# Altium schematic sheet P04-NET.SchDoc
size 817 x 513 mm
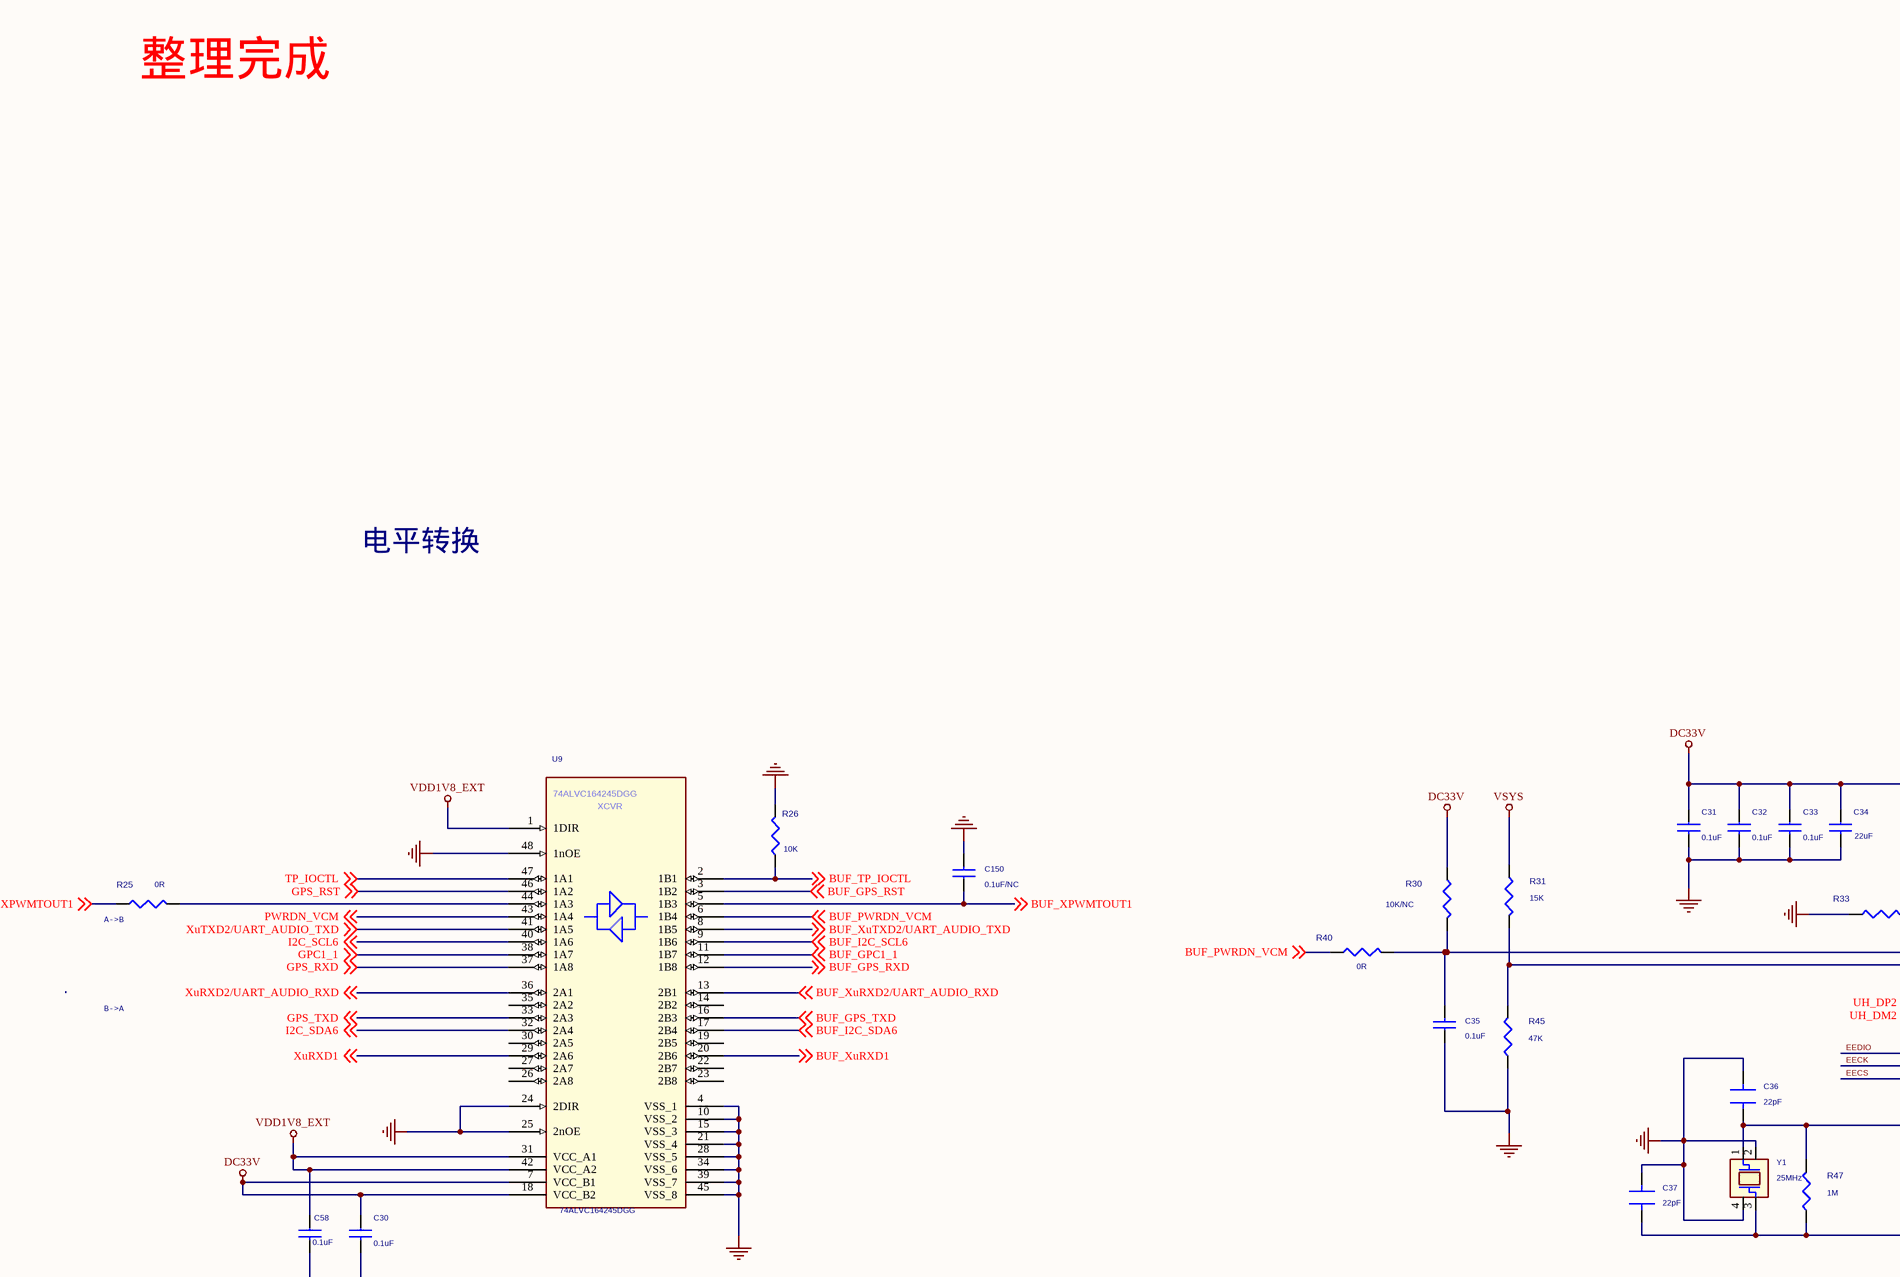
[diagram p0: P04-NET.SchDoc, top left]
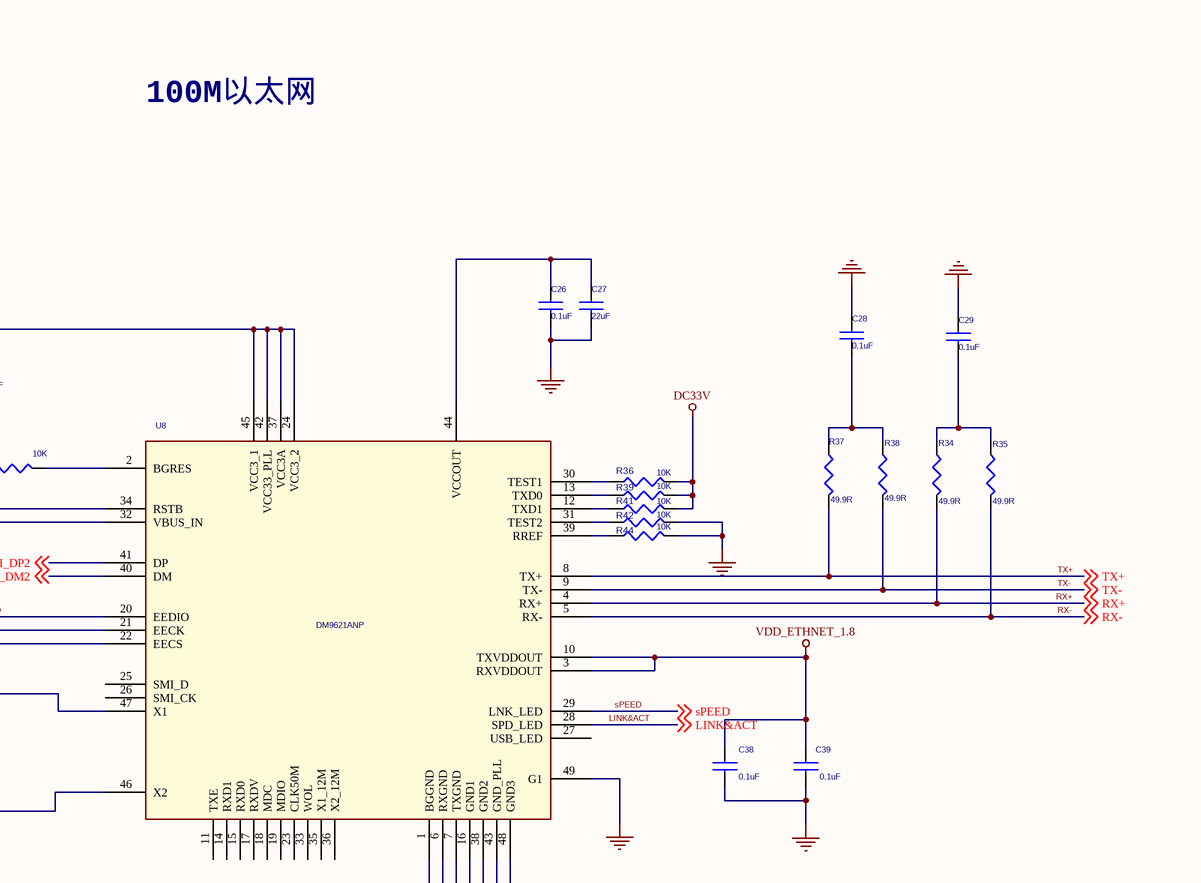
[diagram p1: P04-NET.SchDoc, top right]
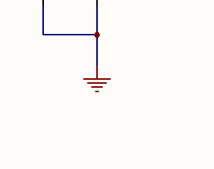
[diagram p2: P04-NET.SchDoc, bottom left]
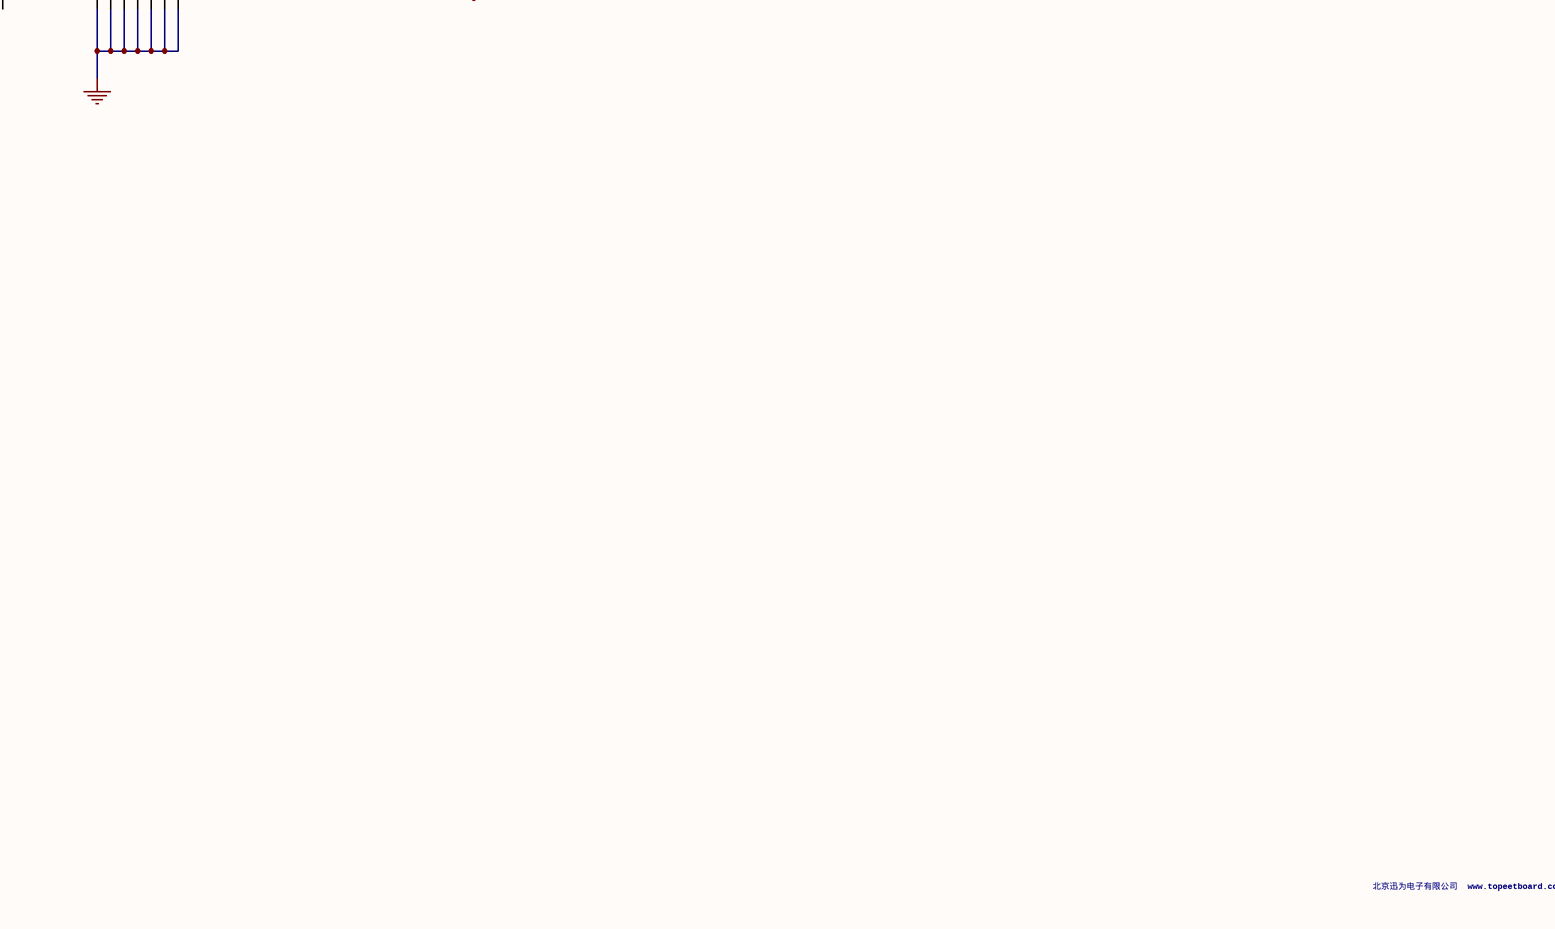
[diagram p3: P04-NET.SchDoc, bottom right]

## Parts
C26  0.1uF  [C0603-S]
C27  22uF  [C1206-S]
C28  0.1uF  [C0603-S]
C29  0.1uF  [C0603-S]
C30  0.1uF  [C0603-S]
C31  0.1uF  [C0603-S]
C32  0.1uF  [C0603-S]
C33  0.1uF  [C0603-S]
C34  22uF  [C1206-S]
C35  0.1uF  [C0603-S]
C36  22pF  [C0603-S]
C37  22pF  [C0603-S]
C38  0.1uF  [C0603-S]
C39  0.1uF  [C0603-S]
C58  0.1uF  [C0603-S]
C150  0.1uF/NC  [C0603-S]
R25  0R  [R0603-S]
R26  10K  [R0603-S]
R30  10K/NC  [R0603-S]
R31  15K  [R0603-S]
R33  10K  [R0603-S]
R34  49.9R  [R0805-S]
R35  49.9R  [R0805-S]
R36  10K  [R0603-S]
R37  49.9R  [R0805-S]
R38  49.9R  [R0805-S]
R39  10K  [R0603-S]
R40  0R  [R0603-S]
R41  10K  [R0603-S]
R42  10K  [R0603-S]
R44  10K  [R0603-S]
R45  47K  [R0603-S]
R47  1M  [R0603-S]
U8  DM9621ANP  [QFN48-050-0707LH]
U9  PART_NUMBER: 74ALVC164245DGG  [TSSOP_48]  (hidden comment: U-74ALVC164245DGG)
Y1  25MHz  [X4-2_5X3_2]

## Nets
DC33V: C30.1 C31.1 C32.1 C33.1 C34.1 R30.2 R36.1 R39.1 R41.1 U8.24(VCC3_2) U8.37(VCC3A) U8.42(VCC33_PLL) U8.45(VCC3_1) U9.7(VCC_B1) U9.18(VCC_B2)
GND: C26.2 C27.2 C28.1 C29.1 C30.2 C31.2 C32.2 C33.2 C34.2 C35.1 C36.2 C37.2 C38.2 C39.2 C58.2 C150.2 R26.1 R33.2 R42.1 R44.1 R45.2 U8.1(BGGND) U8.6(RXGND) U8.7(TXGND) U8.16(GND1) U8.38(GND2) U8.43(GND_PLL) U8.48(GND3) U8.49(G1) U9.4(VSS_1) U9.10(VSS_2) U9.15(VSS_3) U9.21(VSS_4) U9.24(2DIR) U9.25(2nOE) U9.28(VSS_5) U9.34(VSS_6) U9.39(VSS_7) U9.45(VSS_8) U9.48(1nOE) Y1.2(GND) Y1.4(GND)
VDD1V8_EXT: C58.1 U9.1(1DIR) U9.31(VCC_A1) U9.42(VCC_A2)
VDD_ETHNET_1.8: C38.1 C39.1 U8.3(RXVDDOUT) U8.10(TXVDDOUT)
VSYS: R31.2
BUF_GPC1_1: U9.11(1B7) ; off-sheet BUF_GPC1_1
BUF_GPS_RST: U9.3(1B2) ; off-sheet BUF_GPS_RST
BUF_GPS_RXD: U9.12(1B8) ; off-sheet BUF_GPS_RXD
BUF_GPS_TXD: U9.16(2B3) ; off-sheet BUF_GPS_TXD
BUF_I2C_SCL6: U9.9(1B6) ; off-sheet BUF_I2C_SCL6
BUF_I2C_SDA6: U9.17(2B4) ; off-sheet BUF_I2C_SDA6
BUF_PWRDN_VCM: R40.2 U9.6(1B4) ; off-sheet BUF_PWRDN_VCM
BUF_TP_IOCTL: R26.2 U9.2(1B1) ; off-sheet BUF_TP_IOCTL
BUF_XPWMTOUT1: C150.1 U9.5(1B3) ; off-sheet BUF_XPWMTOUT1
BUF_XuRXD1: U9.20(2B6) ; off-sheet BUF_XuRXD1
BUF_XuRXD2/UART_AUDIO_RXD: U9.13(2B1) ; off-sheet BUF_XuRXD2/UART_AUDIO_RXD
BUF_XuTXD2/UART_AUDIO_TXD: U9.8(1B5) ; off-sheet BUF_XuTXD2/UART_AUDIO_TXD
EECK: U8.21(EECK)
EECS: U8.22(EECS)
EEDIO: U8.20(EEDIO)
GPC1_1: U9.38(1A7) ; off-sheet GPC1_1
GPS_RST: U9.46(1A2) ; off-sheet GPS_RST
GPS_RXD: U9.37(1A8) ; off-sheet GPS_RXD
GPS_TXD: U9.33(2A3) ; off-sheet GPS_TXD
I2C_SCL6: U9.40(1A6) ; off-sheet I2C_SCL6
I2C_SDA6: U9.32(2A4) ; off-sheet I2C_SDA6
LINK&ACT: U8.28(SPD_LED) ; off-sheet LINK&ACT
PWRDN_VCM: U9.43(1A4) ; off-sheet PWRDN_VCM
RX+: R34.1 U8.4(RX+) ; off-sheet RX+
RX-: R35.1 U8.5(RX-) ; off-sheet RX-
sPEED: U8.29(LNK_LED) ; off-sheet sPEED
TP_IOCTL: U9.47(1A1) ; off-sheet TP_IOCTL
TX+: R37.1 U8.8(TX+) ; off-sheet TX+
TX-: R38.1 U8.9(TX-) ; off-sheet TX-
UH_DM2: U8.40(DM) ; off-sheet UH_DM2
UH_DP2: U8.41(DP) ; off-sheet UH_DP2
XPWMTOUT1: R25.2 ; off-sheet XPWMTOUT1
XuRXD1: U9.29(2A6) ; off-sheet XuRXD1
XuRXD2/UART_AUDIO_RXD: U9.36(2A1) ; off-sheet XuRXD2/UART_AUDIO_RXD
XuTXD2/UART_AUDIO_TXD: U9.41(1A5) ; off-sheet XuTXD2/UART_AUDIO_TXD
NetC26_1: C26.1 C27.1 U8.44(VCCOUT)
NetC28_2: C28.2 R37.2 R38.2
NetC29_2: C29.2 R34.2 R35.2
NetC35_2: C35.2 R30.1 R40.1 U8.34(RSTB)
NetC36_1: C36.1 R47.1 U8.47(X1) Y1.1(CIN)
NetC37_1: C37.1 R47.2 U8.46(X2) Y1.3(COUT)
NetR25_1: R25.1 U9.44(1A3)
NetR31_1: R31.1 R45.1 U8.32(VBUS_IN)
NetR33_1: R33.1 U8.2(BGRES)
NetR36_2: R36.2 U8.30(TEST1)
NetR39_2: R39.2 U8.13(TXD0)
NetR41_2: R41.2 U8.12(TXD1)
NetR42_2: R42.2 U8.31(TEST2)
NetR44_2: R44.2 U8.39(RREF)

Not connected (* = marked no-connect by the designer): U8 11(TXE) 14(RXD1) 15(RXD0) 17(RXDV) 18(MDC) 19(MDIO) 23(CLK50M) 25(SMI_D) 26(SMI_CK) 27(USB_LED) 33(WOL) 35(X1_12M) 36(X2_12M); U9 14(2B2) 19(2B5) 22(2B7) 23(2B8) 26(2A8) 27(2A7) 30(2A5) 35(2A2)

## Notes on the sheet
- 整理完成
- 电平转换
- 100M以太网
- (near R25) A->B
- B->A
- 北京迅为电子有限公司  www.topeetboard.com
- (in symbol U-74ALVC164245DGG) XCVR

## Library data of the parts
C26 C28-C33 C35 C38 C39 C150 = C1608_Dup1
C27 C34 = C1206_0
C36 C37 = CAP_1
C58 = C0402_0
R25 R26 R30 R31 R33 R36 R39-R42 R44 R45 R47 = RESISTOR_0
R34 R35 R37 R38 = R_Dup2: PAGE: DEBUG
U8 = DM9621NP_1
U9 = U-74ALVC164245DGG: IPN: A78685-001; MFGR: Philips; ValueP: IC,16 Bit XCVR,TSSOP48; DEVICE: 74ALVC164245DGG
Y1 = Y_24.576MHZ-5032